# Altium schematic sheet [03] - CIRCUIT.SchDoc
size A4
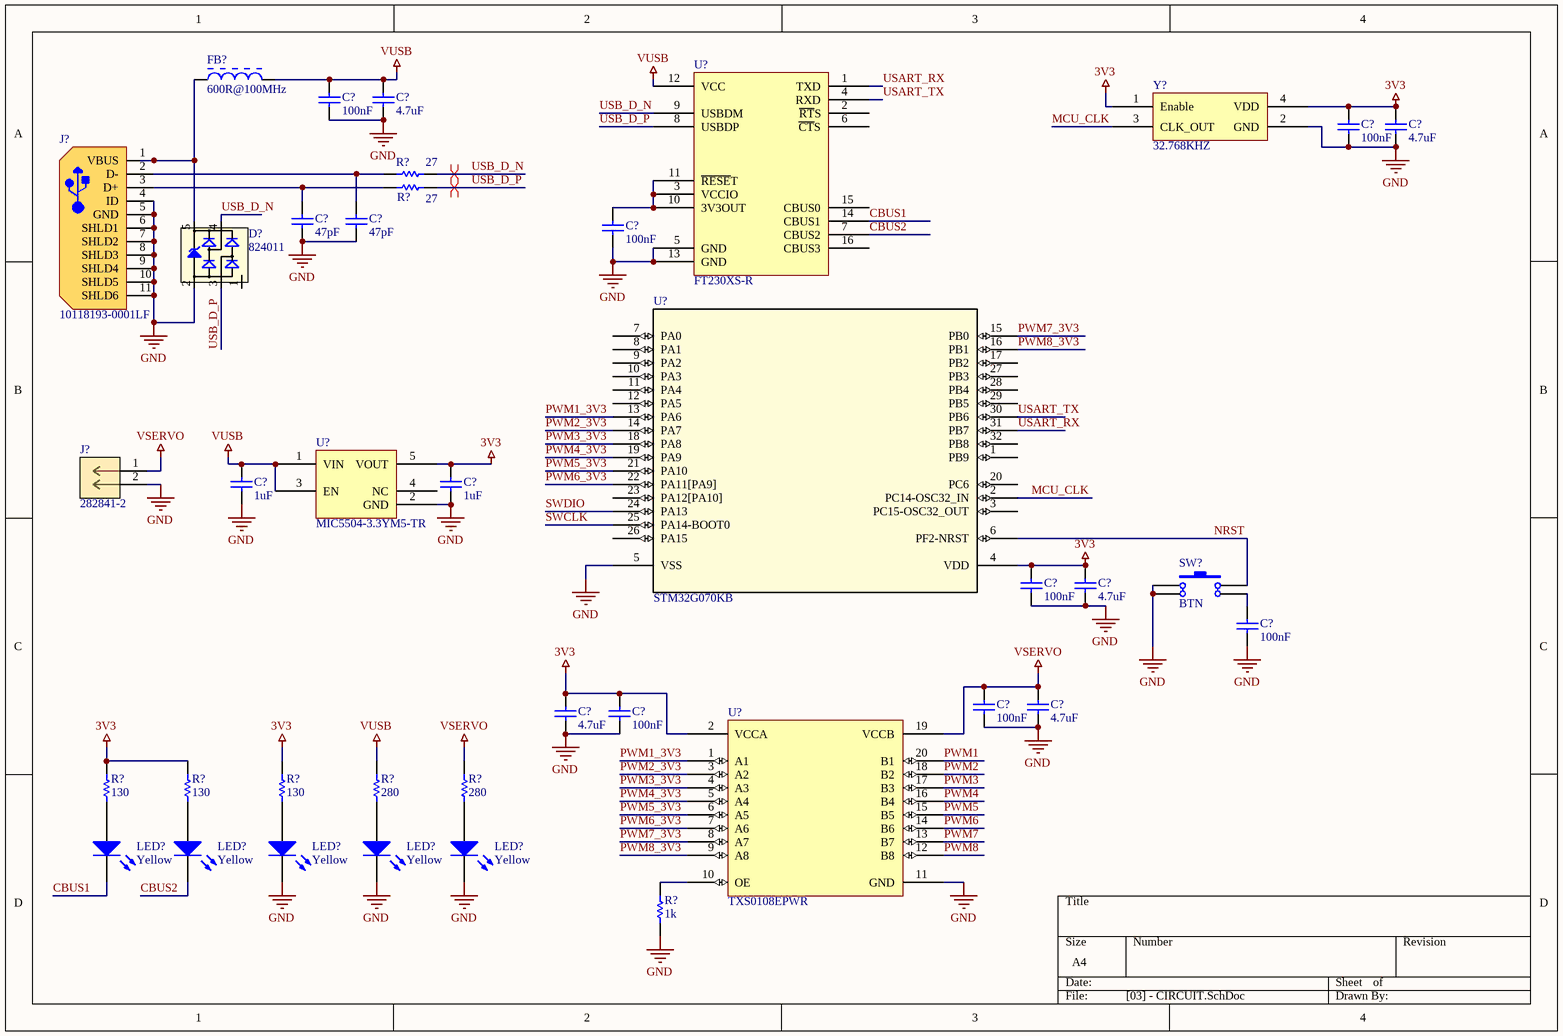
[diagram p0: [03] - CIRCUIT.SchDoc]

## Parts
(Parts that share a designator on the sheet are numbered #1, #2 ... from top to bottom, then left to right.)
C?#1  100nF  [CAPC2012X10N]
C?#2  4.7uF  [CAPC2012X10N]
C?#3  100nF  [CAPC2012X10N]
C?#4  4.7uF  [CAPC2012X10N]
C?#5  47pF  [CAPC2012X10N]
C?#6  47pF  [CAPC2012X10N]
C?#7  100nF  [CAPC2012X10N]
C?#8  Capacitance: 1uF  [CAPC2012X10N]  (hidden comment: CL21B105KOFNNNG)
C?#9  Capacitance: 1uF  [CAPC2012X10N]  (hidden comment: CL21B105KOFNNNG)
C?#10  100nF  [CAPC2012X10N]
C?#11  4.7uF  [CAPC2012X10N]
C?#12  100nF  [CAPC2012X10N]
C?#13  100nF  [CAPC2012X10N]
C?#14  4.7uF  [CAPC2012X10N]
C?#15  4.7uF  [CAPC2012X10N]
C?#16  100nF  [CAPC2012X10N]
D?  824011  [SOT23_5L]
FB?  600R@100MHz  [LIRD-MI0805K601R-10-2_V]
J?#1  10118193-0001LF  [FCI-10118193-0001LF-5_V]
J?#2  282841-2  [CUI_TB001-500-02BE]
LED?#1  Yellow  [LED_0805]
LED?#2  Yellow  [LED_0805]
LED?#3  Yellow  [LED_0805]
LED?#4  Yellow  [LED_0805]
LED?#5  Yellow  [LED_0805]
R?#1  27  [RESC2012X07N]
R?#2  27  [RESC2012X07N]
R?#3  130  [RESC2012X07N]
R?#4  130  [RESC2012X07N]
R?#5  130  [RESC2012X07N]
R?#6  280
R?#7  280
R?#8  value 1k  [RESC2012X07N]  (hidden comment: RMCF0805JT1K00)
SW?  BTN  [Button]
U?#1  FT230XS-R
U?#2  STM32G070KB  [LQFP-32]
U?#3  MIC5504-3.3YM5-TR  [SOT95P280X145-5N]
U?#4  TXS0108EPWR  [TSOP65P640X120-20N]
Y?  32.768KHZ  [KX251]

## Nets
3V3: C?#3.2 C?#4.2 C?#9.2 C?#10.2 C?#11.2 C?#15.2 C?#16.2 R?#3.1 R?#4.1 R?#5.1 U?#2.4(VDD) U?#3.5(VOUT) U?#4.2(VCCA) Y?.1(Enable) Y?.4(VDD)
GND: C?#1.1 C?#2.1 C?#3.1 C?#4.1 C?#5.1 C?#6.1 C?#7.1 C?#8.1 C?#9.1 C?#10.1 C?#11.1 C?#12.1 C?#13.1 C?#14.1 C?#15.1 C?#16.1 D?.2(GND) J?#1.4(ID) J?#1.5(GND) J?#1.6(SHLD1) J?#1.7(SHLD2) J?#1.8(SHLD3) J?#1.9(SHLD4) J?#1.10(SHLD5) J?#1.11(SHLD6) J?#2.2 LED?#3.1(K) LED?#4.1(K) LED?#5.1(K) R?#8.1 SW?.1 SW?.2 U?#1.5(GND) U?#1.13(GND) U?#2.5(VSS) U?#3.2(GND) U?#4.11(GND) Y?.2(GND)
VSERVO: C?#13.2 C?#14.2 J?#2.1 R?#7.2 U?#4.19(VCCB)
VUSB: C?#1.2 C?#2.2 C?#8.2 FB?.2 R?#6.2 U?#1.12(VCC) U?#3.1(VIN) U?#3.3(EN)
CBUS1: LED?#1.1(K) U?#1.14(CBUS1)
CBUS2: LED?#2.1(K) U?#1.7(CBUS2)
MCU_CLK: U?#2.2(PC14-OSC32_IN) Y?.3(CLK_OUT)
NRST: SW?.3 U?#2.6(PF2-NRST)
PWM1: U?#4.20(B1)
PWM1_3V3: U?#2.13(PA6) U?#4.1(A1)
PWM2: U?#4.18(B2)
PWM2_3V3: U?#2.14(PA7) U?#4.3(A2)
PWM3: U?#4.17(B3)
PWM3_3V3: U?#2.18(PA8) U?#4.4(A3)
PWM4: U?#4.16(B4)
PWM4_3V3: U?#2.19(PA9) U?#4.5(A4)
PWM5: U?#4.15(B5)
PWM5_3V3: U?#2.21(PA10) U?#4.6(A5)
PWM6: U?#4.14(B6)
PWM6_3V3: U?#2.22(PA11[PA9]) U?#4.7(A6)
PWM7: U?#4.13(B7)
PWM7_3V3: U?#2.15(PB0) U?#4.8(A7)
PWM8: U?#4.12(B8)
PWM8_3V3: U?#2.16(PB1) U?#4.9(A8)
SWCLK: U?#2.25(PA14-BOOT0)
SWDIO: U?#2.24(PA13)
USART_RX: U?#1.1(TXD) U?#2.31(PB7)
USART_TX: U?#1.4(RXD) U?#2.30(PB6)
USB_D_N: D?.4(I/O2) R?#1.2 U?#1.9(USBDM)
USB_D_P: D?.3(I/O1) R?#2.2 U?#1.8(USBDP)
NetC?#5_2: C?#5.2 J?#1.3(D+) R?#2.1
NetC?#6_2: C?#6.2 J?#1.2(D-) R?#1.1
NetC?#7_2: C?#7.2 U?#1.3(VCCIO) U?#1.10(3V3OUT) U?#1.11(~{RESE}T)
NetC?#12_2: C?#12.2 SW?.4
NetD?_5: D?.5(VDD) FB?.1 J?#1.1(VBUS)
NetLED?#1_2: LED?#1.2(A) R?#3.2
NetLED?#2_2: LED?#2.2(A) R?#4.2
NetLED?#3_2: LED?#3.2(A) R?#5.2
NetLED?#4_2: LED?#4.2(A) R?#6.1
NetLED?#5_2: LED?#5.2(A) R?#7.1
NetR?#8_2: R?#8.2 U?#4.10(OE)

Not connected (* = marked no-connect by the designer): D? 1(NC); U?#1 2(~{RT}S) 6(~{CT}S) 15(CBUS0) 16(CBUS3); U?#2 1(PB9) 3(PC15-OSC32_OUT) 7(PA0) 8(PA1) 9(PA2) 10(PA3) 11(PA4) 12(PA5) 17(PB2) 20(PC6) 23(PA12[PA10]) 26(PA15) 27(PB3) 28(PB4) 29(PB5) 32(PB8); U?#3 4(NC)

## Layout directives
differential pair: USB_D_N, USB_D_P

## Library data of the parts
C?#1 C?#3 C?#7 C?#10 C?#12 C?#13 C?#16 = GCD21BR72A104KA01L: CAP CER 0.1UF 100V X7R 0805; Manufacturer 1: Murata; Supplier 1: Digi-Key; Manufacturer Part Number 1: GCD21BR72A104KA01L; Stock 1: 24933; Pricing 1: 1=0,23000, 10=0,15700, 100=0,08890, 500=0,06278, 1000=0,05494 (USD); RoHS: No; ComponentLink1URL: http://search.murata.co.jp/Ceramy/image/img/A01X/partnumbering_e_02.pdf?src-supplier=Digi-Key; ComponentLink1Description: http://search.murata.co.jp/Ceramy/image/img/A01X/partnumbering_e_02.pdf?src-supplier=Digi-Key; ComponentLink2URL: http://search.murata.co.jp/Ceramy/image/img/A01X/G101/ENG/GCD21BR72A104KA01-01.pdf?src-supplier=Digi-Key; ComponentLink2Description: http://search.murata.co.jp/Ceramy/image/img/A01X/G101/ENG/GCD21BR72A104KA01-01.pdf?src-supplier=Digi-Key; Supplier Part Number 1: 490-14407-1-ND
C?#2 C?#4 C?#11 C?#14 C?#15 = GRM21BR61H475KE51L: Cap Ceramic 4.7uF 50V X5R 10% SMD 0805 85C Embossed T/R; Manufacturer 1: Murata; Supplier 1: Digi-Key; Manufacturer Part Number 1: GRM21BR61H475KE51L; Stock 1: 400593; Pricing 1: 1=0,37000, 10=0,25600, 100=0,15390, 500=0,11540, 1000=0,09745 (USD); RoHS: Yes; Mount: Surface Mount; Case/Package: 0805; Case Code (Metric): 2012; Material: Ceramic; Case Code (Imperial): 0805; Min Operating Temperature: -55°C; Max Operating Temperature: 85°C; Capacitance: 4.7uF; Tolerance: 10%; Packaging: Tape and Reel; Dielectric: X5R; Voltage Rating: 50V; Voltage Rating (DC): 50V; Length: 2mm; Height: 1.25mm; Width: 0.049inch; Thickness: 0.055inch; Depth: 1.25mm; REACH SVHC: No SVHC; Lead Free: Lead Free; ComponentLink1URL: http://components.arrow.com/part/dataview/61084395S454511N2606?src-supplier=Arrow; ComponentLink1Description: http://components.arrow.com/part/dataview/61084395S454511N2606?src-supplier=Arrow; ComponentLink2URL: http://components.arrow.com/part/dataview/0323_07281654?src-supplier=Arrow+Europe; ComponentLink2Description: http://components.arrow.com/part/dataview/0323_07281654?src-supplier=Arrow+Europe; ComponentLink3URL: http://www.farnell.com/datasheets/2079186.pdf?src-supplier=Farnell; ComponentLink3Description: http://www.farnell.com/datasheets/2079186.pdf?src-supplier=Farnell; ComponentLink4URL: https://search.murata.co.jp/Ceramy/image/img/A01X/G101/ENG/GRM21BR61H475KE51-01.pdf?src-supplier=Digi-Key; ComponentLink4Description: https://search.murata.co.jp/Ceramy/image/img/A01X/G101/ENG/GRM21BR61H475KE51-01.pdf?src-supplier=Digi-Key; ComponentLink5URL: http://search.murata.co.jp/Ceramy/image/img/A01X/G101/ENG/GRM21BR61H475KE51-01.pdf?src-supplier=Digi-Key; ComponentLink5Description: http://search.murata.co.jp/Ceramy/image/img/A01X/G101/ENG/GRM21BR61H475KE51-01.pdf?src-supplier=Digi-Key; ComponentLink6URL: http://www.farnell.com/datasheets/2079186.pdf?src-supplier=Element14; ComponentLink6Description: http://www.farnell.com/datasheets/2079186.pdf?src-supplier=Element14; ComponentLink7URL: http://www.farnell.com/datasheets/2079186.pdf?src-supplier=Newark; ComponentLink7Description: http://www.farnell.com/datasheets/2079186.pdf?src-supplier=Newark; Supplier Part Number 1: 490-10751-1-ND; Value: 4.7uF
C?#5 C?#6 = GRM21A5C2D470JW01D: Murata 47pF Multilayer Ceramic Capacitor (MLCC) 200 V 5% C0G dielectric GRM SMD max op. temp. +125C; Voltage Rating: 200V; Temperature Coefficient: 30ppm/°C; Supplier 1: Digi-Key; Manufacturer 1: Murata; Manufacturer Part Number 1: GRM21A5C2D470JW01D; Stock 1: 11086; Pricing 1: 1=0,31000, 10=0,21300, 100=0,12080, 500=0,08530, 1000=0,07463 (USD); RoHS: Yes; Mount: Surface Mount; Case/Package: 0805; Weight: 0.000335oz; Case Code (Imperial): 0805; Case Code (Metric): 2012; Dielectric Material: Ceramic; Min Operating Temperature: -55°C; Max Operating Temperature: 125°C; Capacitance: 47pF; Packaging: Tape and Reel; Voltage: 200V; Dielectric: C0G; Termination: SMD/SMT; Tolerance: 5%; Composition: Ceramic; Voltage Rating (DC): 200V; Package Quantity: 4000; Length: 2mm; Height: 1mm; Width: 0.049inch; Thickness: 0.051inch; Depth: 1.25mm; ComponentLink1URL: http://www.mouser.com/ds/2/281/c02e-2905.pdf?src-supplier=Mouser; ComponentLink1Description: http://www.mouser.com/ds/2/281/c02e-2905.pdf?src-supplier=Mouser; ComponentLink2URL: https://search.murata.co.jp/Ceramy/image/img/A01X/G101/ENG/GRM21A5C2D470JW01-01.pdf?src-supplier=Digi-Key; ComponentLink2Description: https://search.murata.co.jp/Ceramy/image/img/A01X/G101/ENG/GRM21A5C2D470JW01-01.pdf?src-supplier=Digi-Key; ComponentLink3URL: http://search.murata.co.jp/Ceramy/image/img/A01X/G101/ENG/GRM21A5C2D470JW01-01.pdf?src-supplier=Digi-Key; ComponentLink3Description: http://search.murata.co.jp/Ceramy/image/img/A01X/G101/ENG/GRM21A5C2D470JW01-01.pdf?src-supplier=Digi-Key; Supplier Part Number 1: 490-14653-1-ND
C?#8 C?#9 = CL21B105KOFNNNG: Cap Ceramic 1uF 16V X7R 10% SMD 0805 125C Embossed T/R; Manufacturer: Samsung; Supplier 1: Digi-Key; Manufacturer Part Number: CL21B105KOFNNNG; Stock 1: 433201; Pricing 1: 1=0.1, 10=0.047, 100=0.0211, 500=0.0151, 1000=0.0119 (USD); Mount: Surface Mount; Case/Package: 0805; Case Code (Metric): 2012; Case Code (Imperial): 0805; Material: Ceramic; Min Operating Temperature: -55°C; Max Operating Temperature: 125°C; Package Quantity: 3000; Packaging: Tape and Reel; Voltage Rating: 16V; Tolerance: 10%; Dielectric: X7R; Voltage: 16V; Length: 2mm; Height: 1.25mm; Width: 0.049inch; Thickness: 0.053inch; Depth: 1.25mm; Lead Free: Lead Free; ComponentLink1URL: http://www.samsungsem.com/global/support/library/product-catalog/__icsFiles/afieldfile/2014/11/13/MLCC.pdf?src-supplier=Digi-Key; ComponentLink1Description: http://www.samsungsem.com/global/support/library/product-catalog/__icsFiles/afieldfile/2014/11/13/MLCC.pdf?src-supplier=Digi-Key; ComponentLink2URL: http://www1.futureelectronics.com/doc/SAMSUNG%20PASSIVE/CL05B104KQ5NNNC.pdf?src-supplier=Future+Electronics; ComponentLink2Description: http://www1.futureelectronics.com/doc/SAMSUNG%20PASSIVE/CL05B104KQ5NNNC.pdf?src-supplier=Future+Electronics; ComponentLink3URL: https://www.distrelec.biz/Web/Downloads/_e/ng/MLCC_CatalogDownload2013_ENG.pdf?mime=application%2Fpdf&src-supplier=Distrelec; ComponentLink3Description: https://www.distrelec.biz/Web/Downloads/_e/ng/MLCC_CatalogDownload2013_ENG.pdf?mime=application%2Fpdf&src-supplier=Distrelec; ComponentLink4URL: https://produktinfo.conrad.com/datenblaetter/450000-474999/455935-da-01-en-VS_KONDENSATOR_0805.pdf?src-supplier=Conrad; ComponentLink4Description: https://produktinfo.conrad.com/datenblaetter/450000-474999/455935-da-01-en-VS_KONDENSATOR_0805.pdf?src-supplier=Conrad; Supplier Part Number 1: 1276-6471-1-ND
D? = CMP-1474-00002-1: TVS Diode WE-TVS-HS, VRWM=5V; Manufacturer: Wuerth Elektronik; Manufacturer 1: Wurth Electronics; Reverse Stand Off Voltage: 5V; Direction: Unidirectional; Capacitance: 2pF; Polarity: Bidirectional; Number of Bidirectional Channels: 2; Min Breakdown Voltage: 6.1V; Clamping Voltage: 8.5V; Power Line Protection: Yes; Max Reverse Leakage Current: 5A; Test Current: 1mA; Max Surge Current: 12A; Operating Supply Voltage: 6V; ComponentLink2Description: Datasheet; PackageReference: SOT23_5L; ComponentLink2URL: http://katalog.we-online.de/kataloge/eisos/media/pdf/824011.pdf; ComponentLink1Description: Manufacturer URL; ComponentLink1URL: http://www.we-online.com; PartNumber: 824011; Supplier 1: Digi-Key; Manufacturer Part Number 1: 824011; Stock 1: 4096; Pricing 1: 1=0,85000, 10=0,80600, 50=0,75300, 100=0,69900, 500=0,61800 (USD); RoHS: Yes; Mount: Surface Mount; Case/Package: SOT-23; Number of Pins: 5; Min Operating Temperature: -55°C; Max Operating Temperature: 125°C; Package Quantity: 3000; Packaging: Tape and Reel; Reverse Standoff Voltage: 5V; Max Breakdown Voltage: 6.1V; ESD Protection: Yes; Breakdown Voltage: 6.1V; Termination: SMD/SMT; Number of Channels: 2; Working Voltage: 5V; Peak Pulse Current: 12A; Length: 2.9mm; Height: 1.16mm; Width: 2.8mm; REACH SVHC: Unknown; ComponentLink3URL: https://datasheet.ciiva.com/1280/824011-1280657.pdf?src-supplier=Farnell; ComponentLink3Description: https://datasheet.ciiva.com/1280/824011-1280657.pdf?src-supplier=Farnell; ComponentLink4URL: https://datasheet.ciiva.com/15063/824011-15063932.pdf?src-supplier=Digi-Key; ComponentLink4Description: https://datasheet.ciiva.com/15063/824011-15063932.pdf?src-supplier=Digi-Key; ComponentLink5URL: https://datasheet.ciiva.com/25624/0900766b8107e9bf-25624781.pdf?src-supplier=RSComponents; ComponentLink5Description: https://datasheet.ciiva.com/25624/0900766b8107e9bf-25624781.pdf?src-supplier=RSComponents; ComponentLink6URL: https://datasheet.ciiva.com/1276/824011-1276092.pdf?src-supplier=Element14; ComponentLink6Description: https://datasheet.ciiva.com/1276/824011-1276092.pdf?src-supplier=Element14; ComponentLink7URL: https://datasheet.ciiva.com/15063/824011-15063933.pdf?src-supplier=Digi-Key; ComponentLink7Description: https://datasheet.ciiva.com/15063/824011-15063933.pdf?src-supplier=Digi-Key; ComponentLink8URL: https://datasheet.ciiva.com/15063/824011-15063934.pdf?src-supplier=Digi-Key; ComponentLink8Description: https://datasheet.ciiva.com/15063/824011-15063934.pdf?src-supplier=Digi-Key; Supplier Part Number 1: 732-4465-1-ND
FB? = MI0805K601R-10: FERRITE BEAD 600 OHM 0805 1LN; Manufacturer 1: Laird; Current Rating: 1.5A; Impedance: 600R; Number of Lines: 1; DC Resistance (DCR): 100mR; Test Frequency: 100MHz; Supplier 1: Digi-Key; Manufacturer Part Number 1: MI0805K601R-10; Stock 1: 98142; Pricing 1: 1=0,20000, 10=0,16400, 25=0,12800, 50=0,10600, 100=0,09130, 250=0,07304, 500=0,06574, 1000=0,05478 (USD); RoHS: Yes; Mount: Surface Mount; Case/Package: 0805; Weight: 0.00392oz; Case Code (Metric): 2012; Case Code (Imperial): 0805; Core Material: Ferrite; Contact Plating: Tin,Matte; Material: Ferrite; Min Operating Temperature: -40°C; Max Operating Temperature: 125°C; Package Quantity: 1; Packaging: Tape and Reel; Max Current Rating: 1.5A; Max DC Current: 1.5A; Termination: SMD/SMT; Frequency: 100MHz; Length: 2mm; Height: 0.043inch; Width: 0.049inch; Depth: 1.45mm; REACH SVHC: Unknown; Lead Free: Lead Free; ComponentLink1URL: https://datasheet.ciiva.com/22650/1685918-22650417.pdf?src-supplier=Element14; ComponentLink1Description: https://datasheet.ciiva.com/22650/1685918-22650417.pdf?src-supplier=Element14; ComponentLink2URL: https://datasheet.ciiva.com/3082/mi0805k601r-10-a-vp-3082219.pdf?src-supplier=Avnet; ComponentLink2Description: https://datasheet.ciiva.com/3082/mi0805k601r-10-a-vp-3082219.pdf?src-supplier=Avnet; ComponentLink3URL: https://datasheet.ciiva.com/1013/mi0805k601r-10-b-1013299.pdf?src-supplier=Digi-Key; ComponentLink3Description: https://datasheet.ciiva.com/1013/mi0805k601r-10-b-1013299.pdf?src-supplier=Digi-Key; Supplier Part Number 1: 240-2390-1-ND
J?#1 = CMP-2000-05119-1: Micro USB B Type Receptacle, -55 to 85 degC, 5-Pin SMD, RoHS, Tape and Reel; Manufacturer: FCI; Manufacturer 1: Amphenol FCI; Insulation Resistance: 1000MOhms; Gender: Female; Current Rating: 1.8A; Number of Contacts: 5Contact; Connector Type: MicroUSBTypeBreceptacle; Mounting Angle: Right; Number of Ports: 1; Max Voltage Rating (AC): 100V; Pitch: 0.65mm; Datasheet Version: Rev. C, 05/2015; Packaging: Reel; Product Category: USBConnectors; Standard: USB2.0; Factory Pack Quantity: 1200; Operating Temperature Range: -55Cto+85C; Termination Style: SMD/SMT; Datasheet URL: http://datasheet.octopart.com/10118193-0001LF-FCI-datasheet-55953155.pdf; Contact Material: CopperAlloy; RoHS: Details; Contact Plating: Gold; Flammability Rating: UL94V-0; Manufacturer URL: http://www.fci.com/; Brand: FCI; Product: MicroUSBTypeBConnectors; Color: Black; Supplier 1: Digi-Key; Manufacturer Part Number 1: 10118193-0001LF; Stock 1: 33205; Pricing 1: 1=0,43000, 10=0,40500, 25=0,36440, 50=0,32400, 100=0,31040, 250=0,28344, 500=0,26994 (USD); Mount: Surface Mount,Horizontal; Number of Terminals: 5; Housing Material: Polymer; Min Operating Temperature: -55°C; Max Operating Temperature: 85°C; Package Quantity: 1200; Termination: Solder; Voltage Rating: 100V; Orientation: Right Angle; Features: Shielded; Length: 7.86mm; Depth: 5.67mm; Radiation Hardening: No; ComponentLink1URL: https://datasheet.ciiva.com/851/10118193-851106.pdf?src-supplier=Digi-Key; ComponentLink1Description: https://datasheet.ciiva.com/851/10118193-851106.pdf?src-supplier=Digi-Key; ComponentLink2URL: https://datasheet.ciiva.com/14802/10118193-0001lf-webpage-14802386.pdf?src-supplier=Arrow; ComponentLink2Description: https://datasheet.ciiva.com/14802/10118193-0001lf-webpage-14802386.pdf?src-supplier=Arrow; ComponentLink3URL: https://datasheet.ciiva.com/26853/getdatasheetpartid-418618-26853893.pdf?src-supplier=Verical; ComponentLink3Description: https://datasheet.ciiva.com/26853/getdatasheetpartid-418618-26853893.pdf?src-supplier=Verical; ComponentLink4URL: https://datasheet.ciiva.com/4598/10118193ac-197151-4598799.pdf?src-supplier=Mouser; ComponentLink4Description: https://datasheet.ciiva.com/4598/10118193ac-197151-4598799.pdf?src-supplier=Mouser; ComponentLink5URL: https://datasheet.ciiva.com/851/10118193-851107.pdf?src-supplier=Digi-Key; ComponentLink5Description: https://datasheet.ciiva.com/851/10118193-851107.pdf?src-supplier=Digi-Key; ComponentLink6URL: https://datasheet.ciiva.com/851/10118193-851108.pdf?src-supplier=Digi-Key; ComponentLink6Description: https://datasheet.ciiva.com/851/10118193-851108.pdf?src-supplier=Digi-Key; ComponentLink7URL: https://datasheet.ciiva.com/14618/70236827-14618887.pdf?src-supplier=Allied+Electronics; ComponentLink7Description: https://datasheet.ciiva.com/14618/70236827-14618887.pdf?src-supplier=Allied+Electronics; Supplier Part Number 1: 609-4616-1-ND
J?#2 = 282841-2: No Description Available; Manufacturer 1: CUI; Manufacturer Part Number 1: TB001-500-02BE; Vendor: TE Connectivity; Built_By: EMA_UL_Team; Manufacturer_Part_Number: 282841-2; Copyright: Copyright (C) 2016 Accelerated Designs. All rights reserved; RefDes: RefDes; Type: DEV; Value: Value; Supplier 1: Digi-Key; Stock 1: 347; Pricing 1: 1=0,59000, 10=0,32200, 25=0,24040, 50=0,21420, 100=0,21000, 250=0,18480, 500=0,16800, 1000=0,15120, 5000=0,11340 (USD); RoHS: No; Supplier Part Number 1: 102-6134-ND
LED?#1-LED?#5 = CMP-1426-00012-1: SMD mono-color Chip LED, WL-SMCW, Yellow; Manufacturer: Wuerth Elektronik; PartNumber: 150080YS75000; Manufacturer 1: Wurth Electronics; Luminous Intensity: 120mcd; Forward Current: 30mA; Forward Voltage: 2V; Viewing Angle: 140°; Wavelength: 590nm; Lens Style: Clear,Rectangular; Test Current: 20mA; Color: Yellow; ComponentLink1URL: http://www.we-online.com; PackageReference: 0805_A; ComponentLink2URL: http://katalog.we-online.com/led/datasheet/150080YS75000.pdf; ComponentLink1Description: Manufacturer URL; ComponentLink2Description: Datasheet; Supplier 1: Digi-Key; Manufacturer Part Number 1: 150080YS75000; Stock 1: 14510; Pricing 1: 1=0,18000, 50=0,16500, 100=0,14200, 500=0,12300 (USD); RoHS: Yes; Mount: Surface Mount; Case/Package: 0805; Case Code (Metric): 2012; Case Code (Imperial): 0805; Min Operating Temperature: -40°C; Max Operating Temperature: 85°C; Package Quantity: 4000; Packaging: Tape and Reel; Dominant Wavelength: 590nm; Length: 2mm; Height: 0.7mm; Width: 1.25mm; REACH SVHC: Unknown; ComponentLink3URL: https://datasheet.ciiva.com/23843/150080ys75000-23843256.pdf?src-supplier=Newark; ComponentLink3Description: https://datasheet.ciiva.com/23843/150080ys75000-23843256.pdf?src-supplier=Newark; ComponentLink4URL: https://datasheet.ciiva.com/29279/759438-da-01-en-chipled-0805-w-kl-gelb-150080ys75000-29279034.pdf?src-supplier=Conrad; ComponentLink4Description: https://datasheet.ciiva.com/29279/759438-da-01-en-chipled-0805-w-kl-gelb-150080ys75000-29279034.pdf?src-supplier=Conrad; ComponentLink5URL: https://datasheet.ciiva.com/22656/1911353-22656971.pdf?src-supplier=Element14; ComponentLink5Description: https://datasheet.ciiva.com/22656/1911353-22656971.pdf?src-supplier=Element14; ComponentLink6URL: https://datasheet.ciiva.com/29563/150080ys75000-29563019.pdf?src-supplier=Digi-Key; ComponentLink6Description: https://datasheet.ciiva.com/29563/150080ys75000-29563019.pdf?src-supplier=Digi-Key; ComponentLink7URL: https://datasheet.ciiva.com/29563/150080ys75000-29563020.pdf?src-supplier=Digi-Key; ComponentLink7Description: https://datasheet.ciiva.com/29563/150080ys75000-29563020.pdf?src-supplier=Digi-Key; ComponentLink8URL: https://datasheet.ciiva.com/29563/150080ys75000-29563021.pdf?src-supplier=Digi-Key; ComponentLink8Description: https://datasheet.ciiva.com/29563/150080ys75000-29563021.pdf?src-supplier=Digi-Key; Supplier Part Number 1: 732-4987-1-ND
R?#1 R?#2 = RMCF0805FT27R0: RES 27 OHM 1/8W 1% 0805; Manufacturer 1: Stackpole Electronics; Resistance: 27R; Max Power Dissipation: 125mW; Temperature Coefficient: 100ppm/°C; Supplier 1: Digi-Key; Manufacturer Part Number 1: RMCF0805FT27R0; Stock 1: 37447; Pricing 1: 1=0,10000, 10=0,02700, 100=0,01090, 1000=0,00490, 2500=0,00425 (USD); RoHS: Yes; Mount: Surface Mount; Case/Package: 0805; Case Code (Metric): 2012; Case Code (Imperial): 0805; Contact Plating: Tin,Matte; Min Operating Temperature: -55°C; Max Operating Temperature: 155°C; Packaging: Tape and Reel; Tolerance: 1%; Package Quantity: 5000; Composition: Thick Film; Number of Terminations: 2; Features: Automotive AEC-Q200; Length: 0.079inch; Height: 0.026inch; Width: 0.049inch; Radiation Hardening: No; Lead Free: Lead Free; ComponentLink1URL: https://www.seielect.com/catalog/SEI-Packaging.pdf?src-supplier=Digi-Key; ComponentLink1Description: https://www.seielect.com/catalog/SEI-Packaging.pdf?src-supplier=Digi-Key; ComponentLink2URL: https://www.seielect.com/catalog/SEI-RMCF_RMCP.pdf?src-supplier=Avnet; ComponentLink2Description: https://www.seielect.com/catalog/SEI-RMCF_RMCP.pdf?src-supplier=Avnet; ComponentLink3URL: https://www.seielect.com/Catalog/SEI-RMCF_RMCP.pdf?src-supplier=Digi-Key; ComponentLink3Description: https://www.seielect.com/Catalog/SEI-RMCF_RMCP.pdf?src-supplier=Digi-Key; ComponentLink4URL: http://www.seielect.com/Catalog/SEI-RMCF_RMCP.pdf?src-supplier=Digi-Key; ComponentLink4Description: http://www.seielect.com/Catalog/SEI-RMCF_RMCP.pdf?src-supplier=Digi-Key; Supplier Part Number 1: RMCF0805FT27R0CT-ND
R?#3-R?#5 = RMCF0805FT130R: Res Thick Film 0805 130 Ohm 1% 0.125W(1/8W) ±100ppm/C Pad SMD Automotive T/R; Manufacturer 1: Stackpole Electronics; Resistance: 130R; Max Power Dissipation: 125mW; Temperature Coefficient: 100ppm/°C; Supplier 1: Digi-Key; Manufacturer Part Number 1: RMCF0805FT130R; Stock 1: 11107; Pricing 1: 1=0,10000, 10=0,02700, 100=0,01090, 1000=0,00490, 2500=0,00425 (USD); RoHS: Yes; Mount: Surface Mount; Case/Package: 0805; Case Code (Metric): 2012; Case Code (Imperial): 0805; Contact Plating: Tin,Matte; Min Operating Temperature: -55°C; Max Operating Temperature: 155°C; Tolerance: 1%; Packaging: Tape and Reel; Composition: Thick Film; Number of Terminations: 2; Military Standard: Not; Features: Automotive AEC-Q200; Length: 2mm; Height: 0.026inch; Width: 0.049inch; Depth: 1.25mm; Radiation Hardening: No; ComponentLink1URL: https://datasheet.ciiva.com/15193/getdatasheetpartid-717599-15193532.pdf?src-supplier=Verical; ComponentLink1Description: https://datasheet.ciiva.com/15193/getdatasheetpartid-717599-15193532.pdf?src-supplier=Verical; Supplier Part Number 1: RMCF0805FT130RCT-ND
R?#6 R?#7 = RMCF0805FT280R: Res Thick Film 0805 280 Ohm 1% 0.125W(1/8W) ±100ppm/C Pad SMD Automotive T/R; Manufacturer 1: Stackpole Electronics; Resistance: 280R; Max Power Dissipation: 125mW; Temperature Coefficient: 100ppm/°C; Supplier 1: Digi-Key; Manufacturer Part Number 1: RMCF0805FT280R; Stock 1: 4051; Pricing 1: 1=0,10000, 10=0,02700, 100=0,01090, 1000=0,00490, 2500=0,00425 (USD); RoHS: Yes; Mount: Surface Mount; Case/Package: 0805; Case Code (Metric): 2012; Case Code (Imperial): 0805; Contact Plating: Tin,Matte; Min Operating Temperature: -55°C; Max Operating Temperature: 155°C; Tolerance: 1%; Packaging: Tape and Reel; Composition: Thick Film; Number of Terminations: 2; Features: Automotive AEC-Q200; Length: 0.079inch; Height: 0.026inch; Width: 0.049inch; Radiation Hardening: No; Lead Free: Lead Free; ComponentLink1URL: http://components.arrow.com/part/dataview/47832257S8035356N1174?src-supplier=Arrow; ComponentLink1Description: http://components.arrow.com/part/dataview/47832257S8035356N1174?src-supplier=Arrow; ComponentLink2URL: https://www.seielect.com/catalog/SEI-RMCF_RMCP.pdf?src-supplier=Avnet; ComponentLink2Description: https://www.seielect.com/catalog/SEI-RMCF_RMCP.pdf?src-supplier=Avnet; ComponentLink3URL: https://www.seielect.com/Catalog/SEI-RMCF_RMCP.pdf?src-supplier=Digi-Key; ComponentLink3Description: https://www.seielect.com/Catalog/SEI-RMCF_RMCP.pdf?src-supplier=Digi-Key; ComponentLink4URL: https://www.seielect.com/catalog/SEI-Packaging.pdf?src-supplier=Digi-Key; ComponentLink4Description: https://www.seielect.com/catalog/SEI-Packaging.pdf?src-supplier=Digi-Key; Supplier Part Number 1: RMCF0805FT280RCT-ND
R?#8 = RMCF0805JT1K00: RES 1K OHM 5% 1/8W 0805; Manufacturer: Stackpole Electronics; Resistance: 1kR; Power Rating: 125mW; Temperature Coefficient: 100ppm/°C; Supplier 1: Digi-Key; Manufacturer Part Number: RMCF0805JT1K00; Stock 1: 1042028; Pricing 1: 1=0.1, 10=0.02, 100=0.0082, 1000=0.0037, 2500=0.0032 (USD); Mount: Surface Mount; Case/Package: 0805; Case Code (Metric): 2012; Case Code (Imperial): 0805; Contact Plating: Tin,Matte; Min Operating Temperature: -55°C; Max Operating Temperature: 155°C; Packaging: Tape and Reel; Tolerance: 5%; Composition: Thick Film; Number of Terminations: 2; Military Standard: Not; Max Power Dissipation: 125mW; Features: Automotive AEC-Q200; Length: 2mm; Height: 0.026inch; Width: 0.049inch; Depth: 1.25mm; Radiation Hardening: No; Lead Free: Lead Free; ComponentLink1URL: https://www.verical.com/server-webapp/html/getDatasheet?partID=362050&src-supplier=Verical; ComponentLink1Description: https://www.verical.com/server-webapp/html/getDatasheet?partID=362050&src-supplier=Verical; ComponentLink2URL: https://www.seielect.com/catalog/SEI-RMCF_RMCP.pdf?src-supplier=Avnet; ComponentLink2Description: https://www.seielect.com/catalog/SEI-RMCF_RMCP.pdf?src-supplier=Avnet; ComponentLink3URL: http://www.seielect.com/catalog/sei-rmc.pdf?src-supplier=Future+Electronics; ComponentLink3Description: http://www.seielect.com/catalog/sei-rmc.pdf?src-supplier=Future+Electronics; ComponentLink4URL: https://www.seielect.com/catalog/SEI-Packaging.pdf?src-supplier=Digi-Key; ComponentLink4Description: https://www.seielect.com/catalog/SEI-Packaging.pdf?src-supplier=Digi-Key; ComponentLink5URL: http://components.arrow.com/part/dataview/50503305S7171764N1174?src-supplier=Arrow; ComponentLink5Description: http://components.arrow.com/part/dataview/50503305S7171764N1174?src-supplier=Arrow; ComponentLink6URL: https://www.seielect.com/Catalog/SEI-RMCF_RMCP.pdf?src-supplier=Digi-Key; ComponentLink6Description: https://www.seielect.com/Catalog/SEI-RMCF_RMCP.pdf?src-supplier=Digi-Key; Supplier Part Number 1: RMCF0805JT1K00CT-ND
SW? = PTS647SK70SMTR2LFS: INWALL LENS COVER , WHITE , 6 (; Manufacturer: ITT C&K; Supplier 1: Digi-Key; Manufacturer Part Number: PTS647SK70SMTR2LFS; Stock 1: 97905; Pricing 1: 1 = 0,14000, 10 = 0,14000, 25 = 0,13520, 50 = 0,13020, 100 = 0,12310, 250 = 0,11580, 500 = 0,11100 (USD); RoHS: No; Supplier Part Number 1: PTS647SK70SMTR2LFSCT-ND
U?#1 = FT230XS-R: IC USB SERIAL BASIC UART 16SSOP; Manufacturer 1: FTDI; Data Rate: 12Mbps; Operating Supply Voltage: 5V; Number of Channels: 1; Max Supply Voltage: 5.5V; Min Supply Voltage: 2.97V; Interface: UART,USB; Operating Supply Current: 8mA; Memory Type: FLASH; Core Architecture: ARM; Data Bus Width: 32b; Max Frequency: 64MHz; Memory Size: 128KB; RAM Size: 36KB; Number of I/Os: 29; Number of ADC Channels: 13; Supplier 1: Digi-Key; Manufacturer Part Number 1: FT230XS-R; Stock 1: 43316; Pricing 1: 1=2,04000, 25=1,97000, 100=1,90000, 250=1,71000, 500=1,54000, 1000=1,48063 (USD); RoHS: Yes; Mount: Surface Mount; Case/Package: SSOP; Number of Pins: 16; Weight: 0.004586oz; Min Operating Temperature: -40°C; Max Operating Temperature: 85°C; Packaging: Tape and Reel; Package Quantity: 3000; Length: 5mm; Height: 0.059inch; Width: 0.157inch; ComponentLink1URL: https://datasheet.ciiva.com/1787/ds-ft230x-1787315.pdf?src-supplier=Digi-Key; ComponentLink1Description: https://datasheet.ciiva.com/1787/ds-ft230x-1787315.pdf?src-supplier=Digi-Key; ComponentLink2URL: https://datasheet.ciiva.com/4787/ds-ft230x-5395-4787571.pdf?src-supplier=Mouser; ComponentLink2Description: https://datasheet.ciiva.com/4787/ds-ft230x-5395-4787571.pdf?src-supplier=Mouser; ComponentLink3URL: https://datasheet.ciiva.com/30478/0900766b811020cb-30478167.pdf?src-supplier=RSComponents; ComponentLink3Description: https://datasheet.ciiva.com/30478/0900766b811020cb-30478167.pdf?src-supplier=RSComponents; ComponentLink4URL: https://datasheet.ciiva.com/1787/ft-x-series-1787316.pdf?src-supplier=Digi-Key; ComponentLink4Description: https://datasheet.ciiva.com/1787/ft-x-series-1787316.pdf?src-supplier=Digi-Key; ComponentLink5URL: https://datasheet.ciiva.com/1787/ft-x-series-1787317.pdf?src-supplier=Digi-Key; ComponentLink5Description: https://datasheet.ciiva.com/1787/ft-x-series-1787317.pdf?src-supplier=Digi-Key; Supplier Part Number 1: 768-1135-1-ND; ComponentLink6URL: https://datasheet.ciiva.com/71223/stm32g070cb-1517433-71223599.pdf?src-supplier=Mouser; ComponentLink6Description: https://datasheet.ciiva.com/71223/stm32g070cb-1517433-71223599.pdf?src-supplier=Mouser
U?#2 = STM32G070KB: Manufacturer_Part_Number: STM32G0_LQFP32_T1; Manufacturer Part Number 1: STM32G070KBT6; Built_By: EMA_Jessica; Vendor: STMicroelectronics; Interface: I2C,SPI,I2S,USART,LIN; Memory Type: FLASH; Core Architecture: ARM; Data Bus Width: 32b; Max Frequency: 64MHz; Memory Size: 128KB; RAM Size: 36KB; Number of I/Os: 29; Number of ADC Channels: 13; Max Supply Voltage: 3.6V; Min Supply Voltage: 2V; Copyright: Copyright (C) 2016 Accelerated Designs. All rights reserved; RefDes: RefDes; Type: DEV; Value: Value; Supplier 1: Mouser; Manufacturer 1: STMicroelectronics; Stock 1: 627; Pricing 1: 1=1,60000, 10=1,36000, 100=1,09000, 500=0,95700, 1000=0,79300, 2500=0,73800, 5000=0,71100, 10000=0,68300, 25000=0,65700 (USD); RoHS: No; Case/Package: LQFP; Min Operating Temperature: -40°C; Max Operating Temperature: 85°C; Package Quantity: 250; ComponentLink1URL: https://datasheet.ciiva.com/71223/stm32g070cb-1517433-71223599.pdf?src-supplier=Mouser; ComponentLink1Description: https://datasheet.ciiva.com/71223/stm32g070cb-1517433-71223599.pdf?src-supplier=Mouser; Supplier Part Number 1: 511-STM32G070KBT6
U?#3 = MIC5504-3.3YM5-TR: LDO VOLT REG, 0.3A, 3.3V, SOT-23-5; Manufacturer 1: Microchip Micrel; Min Input Voltage: 2.5V; Max Input Voltage: 5.5V; Output Current: 300mA; Dropout Voltage: 380mV; Number of Outputs: 1; Quiescent Current: 38uA; Accuracy: 3%; Operating Supply Current: 42uA; Power Supply Rejection Ratio (PSRR): 60dB; Output Type: Fixed; Supplier 1: Digi-Key; Manufacturer Part Number 1: MIC5504-3.3YM5-TR; Stock 1: 76136; Pricing 1: 1=0,11000, 25=0,09000 (USD); RoHS: Yes; Mount: Surface Mount; Case/Package: SOT-23-5; Number of Pins: 5; Min Operating Temperature: -40°C; Max Operating Temperature: 125°C; Nominal Output Voltage: 3.3V; Packaging: Tape and Reel; Output Voltage: 3.3V; Max Output Current: 300mA; Length: 2.9mm; Height: 1.1mm; Width: 1.6mm; REACH SVHC: No SVHC; ComponentLink1URL: https://datasheet.ciiva.com/46425/1856860-46425639.pdf?src-supplier=Element14; ComponentLink1Description: https://datasheet.ciiva.com/46425/1856860-46425639.pdf?src-supplier=Element14; Supplier Part Number 1: 576-4764-1-ND
U?#4 = TXS0108EPWR: TRANSLATOR, VOLTAGE, 8BIT, 20TSSOP; Manufacturer 1: Texas Instruments; Number of Inputs: 8; Propagation Delay: 4.8ns; Min Supply Voltage: 1.2V; Max Supply Voltage: 5.5V; Data Rate: 60Mbps; Rise Time: 6.3ns; Output Current: 620uA; High Level Output Current: -50mA; Low Level Output Current: 50mA; Turn-On Delay Time: 312ns; Quiescent Current: 3uA; Nominal Supply Current: 8uA; Supplier 1: Digi-Key; Manufacturer Part Number 1: TXS0108EPWR; Stock 1: 31907; Pricing 1: 1=1,66000, 10=1,49000, 100=1,19790, 500=0,98416, 1000=0,81545 (USD); RoHS: Yes; Mount: Surface Mount; Case/Package: TSSOP; Number of Pins: 20; Weight: 0.002716oz; Contact Plating: Gold; Min Operating Temperature: -40°C; Max Operating Temperature: 85°C; Number of Channels: 8; Package Quantity: 1; Packaging: Tape and Reel; Logic Function: Translator; Number of Bits: 8; Termination: SMD/SMT; Output Type: Voltage; Length: 6.5mm; Height: 1.15mm; Width: 4.4mm; Radiation Hardening: No; REACH SVHC: No SVHC; Lead Free: Lead Free; ComponentLink1URL: https://datasheet.ciiva.com/14287/txs0108e-14287280.pdf?src-supplier=Farnell; ComponentLink1Description: https://datasheet.ciiva.com/14287/txs0108e-14287280.pdf?src-supplier=Farnell; ComponentLink2URL: https://datasheet.ciiva.com/4834/sces642b-127094-4834401.pdf?src-supplier=Mouser; ComponentLink2Description: https://datasheet.ciiva.com/4834/sces642b-127094-4834401.pdf?src-supplier=Mouser; ComponentLink3URL: https://datasheet.ciiva.com/15096/getdatasheetpartid-322119-15096276.pdf?src-supplier=Verical; ComponentLink3Description: https://datasheet.ciiva.com/15096/getdatasheetpartid-322119-15096276.pdf?src-supplier=Verical; ComponentLink4URL: https://datasheet.ciiva.com/28653/1714661-28653429.pdf?src-supplier=Element14; ComponentLink4Description: https://datasheet.ciiva.com/28653/1714661-28653429.pdf?src-supplier=Element14; ComponentLink5URL: https://datasheet.ciiva.com/1899/txs0108e-1899604.pdf?src-supplier=Digi-Key; ComponentLink5Description: https://datasheet.ciiva.com/1899/txs0108e-1899604.pdf?src-supplier=Digi-Key; ComponentLink6URL: https://datasheet.ciiva.com/1899/txs0108e-1899605.pdf?src-supplier=Digi-Key; ComponentLink6Description: https://datasheet.ciiva.com/1899/txs0108e-1899605.pdf?src-supplier=Digi-Key; ComponentLink7URL: https://datasheet.ciiva.com/1899/txs0108e-1899606.pdf?src-supplier=Digi-Key; ComponentLink7Description: https://datasheet.ciiva.com/1899/txs0108e-1899606.pdf?src-supplier=Digi-Key; ComponentLink8URL: https://datasheet.ciiva.com/1508/1815244-1508732.pdf?src-supplier=Element14; ComponentLink8Description: https://datasheet.ciiva.com/1508/1815244-1508732.pdf?src-supplier=Element14; ComponentLink9URL: https://datasheet.ciiva.com/14287/txs0108e-14287532.pdf?src-supplier=Avnet; ComponentLink9Description: https://datasheet.ciiva.com/14287/txs0108e-14287532.pdf?src-supplier=Avnet; ComponentLink10URL: https://datasheet.ciiva.com/26039/txs0108e-26039599.pdf?src-supplier=Avnet+Europe; ComponentLink10Description: https://datasheet.ciiva.com/26039/txs0108e-26039599.pdf?src-supplier=Avnet+Europe; Supplier Part Number 1: 296-23011-1-ND
Y? = KX2511A0032.768000: OSCILLATOR XO 32.768KHZ CMOS SMD; Manufacturer 1: Diodes; Max Supply Current: 15uA; Frequency Stability: 20ppm; Supplier 1: Digi-Key; Manufacturer Part Number 1: KX2511A0032.768000; Stock 1: 49; Pricing 1: 1=1,42000, 10=1,35900, 50=1,32720, 100=1,13760, 500=1,10600, 1000=0,93220, 3000=0,88480, 6000=0,85320, 12000=0,82160 (USD); RoHS: Yes; Mount: Surface Mount; Case/Package: SMD/SMT; Min Operating Temperature: -20°C; Max Operating Temperature: 70°C; Package Quantity: 100; Frequency: 32.768kHz; Packaging: Cut Strip; Length: 0.098inch; Height: 0.039inch; Width: 0.079inch; ComponentLink1URL: https://datasheet.ciiva.com/18649/kx251-rev-c-18649469.pdf?src-supplier=Digi-Key; ComponentLink1Description: https://datasheet.ciiva.com/18649/kx251-rev-c-18649469.pdf?src-supplier=Digi-Key; Supplier Part Number 1: KX2511A0032.768000-ND